# Altium schematic sheet CDR_WR_oscillators.SchDoc: RFSoC AMC
size 420 x 297 mm; CmpIndex: 26; CompanyName: WUT; DrawnBy: T. Przywozki; Organization: WUT ISE; Address1: Warsaw University of Technology; Address2: Nowowiejska 15/19 00-665 Warsaw; Address3: Tomasz.Przywozki@pw.edu.pl; DocumentNumber: 45; Revision: 1; SheetNumber: 45; SheetTotal: 45; Project: RFSoC AMC; ModifiedBy: T. Przywozki; CreateDate: -; CheckedDate: -; DivGrp: ISE; Designer: T. Przywozki; ModifiedDate: -; ProjectName: ADC/DAC MEZZANINE
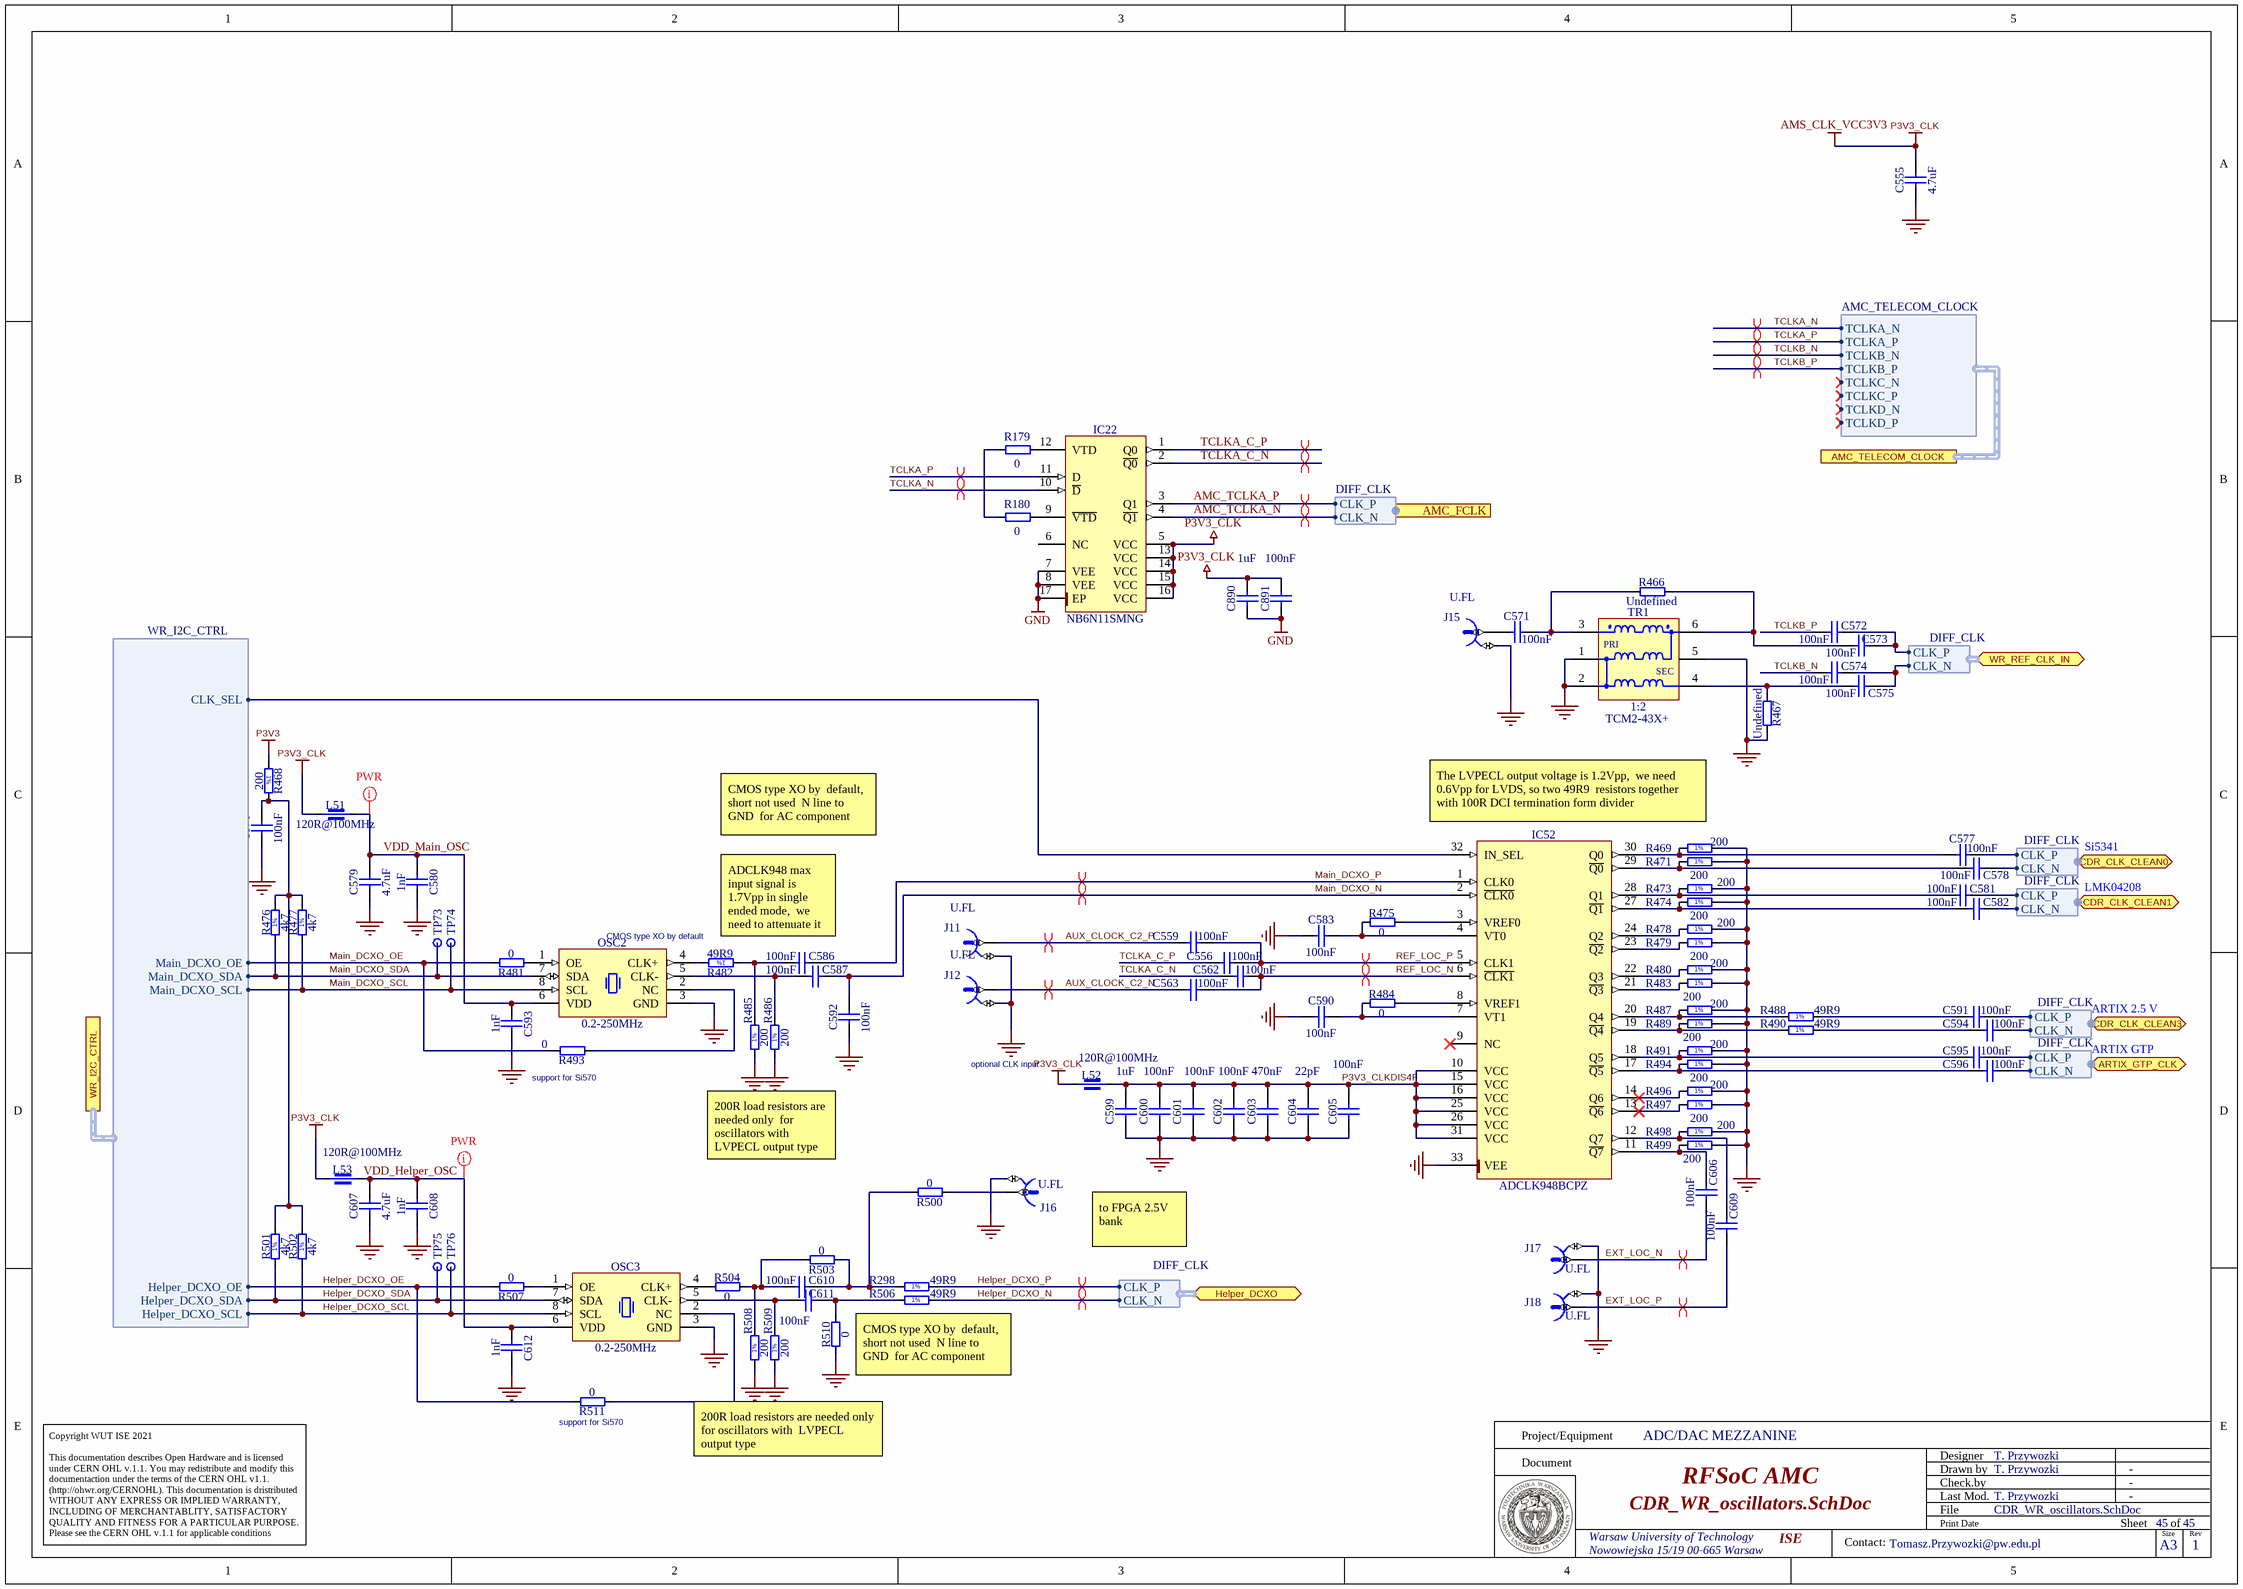
[diagram p0: CDR_WR_oscillators.SchDoc]

## Parts
C555  4.7uF  [CAPC1608X90N]
C556  100nF  [CAPC1005X55N]
C559  100nF  [CAPC1005X55N]
C562  100nF  [CAPC1005X55N]
C563  100nF  [CAPC1005X55N]
C571  100nF  [CAPC1005X55N]
C572  100nF  [CAPC1005X55N]
C573  100nF  [CAPC1005X55N]
C574  100nF  [CAPC1005X55N]
C575  100nF  [CAPC1005X55N]
C576  100nF  [CAPC0603X33N]
C577  100nF  [CAPC0603X33N]
C578  100nF  [CAPC0603X33N]
C579  4.7uF  [CAPC1608X90N]
C580  1nF  [CAPC0603X33N]
C581  100nF  [CAPC0603X33N]
C582  100nF  [CAPC0603X33N]
C583  100nF  [CAPC0603X33N]
C586  100nF  [CAPC1005X55N]
C587  100nF  [CAPC1005X55N]
C590  100nF  [CAPC0603X33N]
C591  100nF  [CAPC0603X33N]
C592  100nF  [CAPC0603X33N]
C593  1nF  [CAPC0603X33N]
C594  100nF  [CAPC0603X33N]
C595  100nF  [CAPC0603X33N]
C596  100nF  [CAPC0603X33N]
C599  1uF  [CAPC1005X55N]
C600  100nF  [CAPC0603X33N]
C601  100nF  [CAPC0603X33N]
C602  100nF  [CAPC0603X33N]
C603  470nF  [CAPC1005X55N]
C604  22pF  [CAPC1005X55N]
C605  100nF  [CAPC0603X33N]
C606  100nF  [CAPC0603X33N]
C607  4.7uF  [CAPC1608X90N]
C608  1nF  [CAPC0603X33N]
C609  100nF  [CAPC0603X33N]
C610  100nF  [CAPC1005X55N]
C611  100nF  [CAPC1005X55N]
C612  1nF  [CAPC0603X33N]
C890  1uF  [CAPC1005X55N]
C891  100nF  [CAPC0603X33N]
IC22  NB6N11SMNG  [QFN50P300X300X100-17N-S185]
IC52  ADCLK948BCPZ  [QFN50P500X500X80-33N-S285]
J11  U.FL  [HIROSE_U.FL-R-SMT-1(10)]
J12  U.FL  [HIROSE_U.FL-R-SMT-1(10)]
J15  U.FL  [HIROSE_U.FL-R-SMT-1(10)]
J16  U.FL  [HIROSE_U.FL-R-SMT-1(10)]
J17  U.FL  [HIROSE_U.FL-R-SMT-1(10)]
J18  U.FL  [HIROSE_U.FL-R-SMT-1(10)]
L51  120R@100MHz  [INDC1608X95N]
L52  120R@100MHz  [INDC1608X95N]
L53  120R@100MHz  [INDC1608X95N]
OSC2  0.2-250MHz  [OSC_SILICON-LAB_SI549-A]
OSC3  0.2-250MHz  [OSC_SILICON-LAB_SI549-A]
R179  0  [RESC1005X40N]
R180  0  [RESC1005X40N]
R298  49R9  [RESC1005X40N]
R466  Undefined  [RESC1005X40N]
R467  Undefined  [RESC1005X40N]
R468  200  [RESC1005X40N]
R469  200  [RESC1005X40N]
R471  200  [RESC1005X40N]
R473  200  [RESC1005X40N]
R474  200  [RESC1005X40N]
R475  0  [RESC1005X40N]
R476  4k7  [RESC1005X40N]
R477  4k7  [RESC1005X40N]
R478  200  [RESC1005X40N]
R479  200  [RESC1005X40N]
R480  200  [RESC1005X40N]
R481  0  [RESC1005X40N]
R482  49R9  [RESC1005X40N]
R483  200  [RESC1005X40N]
R484  0  [RESC1005X40N]
R485  200  [RESC1005X40N]
R486  200  [RESC1005X40N]
R487  200  [RESC1005X40N]
R488  49R9  [RESC1005X40N]
R489  200  [RESC1005X40N]
R490  49R9  [RESC1005X40N]
R491  200  [RESC1005X40N]
R493  0  [RESC1005X40N]
R494  200  [RESC1005X40N]
R496  200  [RESC1005X40N]
R497  200  [RESC1005X40N]
R498  200  [RESC1005X40N]
R499  200  [RESC1005X40N]
R500  0  [RESC1005X40N]
R501  4k7  [RESC1005X40N]
R502  4k7  [RESC1005X40N]
R503  0  [RESC1005X40N]
R504  0  [RESC1005X40N]
R506  49R9  [RESC1005X40N]
R507  0  [RESC1005X40N]
R508  200  [RESC1005X40N]
R509  200  [RESC1005X40N]
R510  0  [RESC1005X40N]
R511  0  [RESC1005X40N]
TP73  Test Point  [TPS127]  (value not drawn)
TP74  Test Point  [TPS127]  (value not drawn)
TP75  Test Point  [TPS127]  (value not drawn)
TP76  Test Point  [TPS127]  (value not drawn)
TR1  1:2  Manufacturer Part Number: TCM2-43X+  [XFMR_MINI-CIRCUITS_DB1627]

## Ports
AMC_FCLK (harness DIFF_CLK), AMC_TELECOM_CLOCK (harness AMC_TELECOM_CLOCK), ARTIX_GTP_CLK (bidir, harness DIFF_CLK), CDR_CLK_CLEAN0 (bidir, harness DIFF_CLK), CDR_CLK_CLEAN1 (bidir, harness DIFF_CLK), CDR_CLK_CLEAN3 (bidir, harness DIFF_CLK), Helper_DCXO (bidir, harness DIFF_CLK), WR_I2C_CTRL (harness WR_I2C_CTRL), WR_REF_CLK_IN (bidir, harness DIFF_CLK)

## Harnesses
AMC_TELECOM_CLOCK: TCLKA_N, TCLKA_P, TCLKB_N, TCLKB_P, TCLKC_N, TCLKC_P, TCLKD_N, TCLKD_P
WR_I2C_CTRL: Main_DCXO_OE, Main_DCXO_SDA, Main_DCXO_SCL, Helper_DCXO_OE, Helper_DCXO_SDA, Helper_DCXO_SCL, CLK_SEL
DIFF_CLK: CLK_P, CLK_N

## Nets
AMS_CLK_VCC3V3: C555.2 C890.1 C891.2 IC22.5(VCC) IC22.13(VCC) IC22.14(VCC) IC22.15(VCC) IC22.16(VCC) L51.1 L52.1 L53.1  [also labelled P3V3_CLK]
GND: C555.1 C576.1 C579.1 C580.1 C583.1 C590.1 C592.1 C593.1 C599.2 C600.1 C601.1 C602.1 C603.1 C604.1 C605.1 C607.1 C608.1 C612.1 C890.2 C891.1 IC22.7(VEE) IC22.8(VEE) IC22.17(EP) IC52.33(VEE) J11.2 J12.2 J15.2 J16.2 J17.2 J18.2 OSC2.3(GND) OSC3.3(GND) R467.1 R469.2 R471.2 R473.2 R474.2 R478.2 R479.2 R480.2 R483.2 R485.1 R486.1 R487.2 R489.2 R491.2 R494.2 R496.2 R497.2 R498.2 R499.2 R508.1 R509.1 R510.1 TR1.1(P1) TR1.2(P1) TR1.5(NC)
P3V3: R468.1
AMC_TCLKA_N: IC22.4(~{Q1}) ; port AMC_FCLK.CLK_N
AMC_TCLKA_P: IC22.3(Q1) ; port AMC_FCLK.CLK_P
AUX_CLOCK_C2_N: C563.1 J12.1
AUX_CLOCK_C2_P: C559.1 J11.1
EXT_LOC_N: C606.2 J17.1
EXT_LOC_P: C609.2 J18.1
Helper_DCXO_N: R506.2 ; port Helper_DCXO.CLK_N
Helper_DCXO_OE: R507.2 R511.2 ; port WR_I2C_CTRL.Helper_DCXO_OE
Helper_DCXO_P: R298.2 ; port Helper_DCXO.CLK_P
Helper_DCXO_SCL: OSC3.8(SCL) R502.1 TP76.1 ; port WR_I2C_CTRL.Helper_DCXO_SCL
Helper_DCXO_SDA: OSC3.7(SDA) R501.1 TP75.1 ; port WR_I2C_CTRL.Helper_DCXO_SDA
Main_DCXO_N: C587.2 C592.2 IC52.2(~{CLK0})
Main_DCXO_OE: R481.2 R493.2 ; port WR_I2C_CTRL.Main_DCXO_OE
Main_DCXO_P: C586.2 IC52.1(CLK0)
Main_DCXO_SCL: OSC2.8(SCL) R477.1 TP74.1 ; port WR_I2C_CTRL.Main_DCXO_SCL
Main_DCXO_SDA: OSC2.7(SDA) R476.1 TP73.1 ; port WR_I2C_CTRL.Main_DCXO_SDA
P3V3_CLKDIS4F: C599.1 C600.2 C601.2 C602.2 C603.2 C604.2 C605.2 IC52.10(VCC) IC52.15(VCC) IC52.16(VCC) IC52.25(VCC) IC52.26(VCC) IC52.31(VCC) L52.2
REF_LOC_N: C562.2 C563.2 IC52.6(~{CLK1})
REF_LOC_P: C556.2 C559.2 IC52.5(CLK1)
TCLKA_C_N: C562.1 IC22.2(~{Q0})
TCLKA_C_P: C556.1 IC22.1(Q0)
TCLKA_N: IC22.10(~{D}) ; port AMC_TELECOM_CLOCK.TCLKA_N
TCLKA_P: IC22.11(D) ; port AMC_TELECOM_CLOCK.TCLKA_P
TCLKB_N: C574.1 ; port AMC_TELECOM_CLOCK.TCLKB_N
TCLKB_P: C572.1 ; port AMC_TELECOM_CLOCK.TCLKB_P
VDD_Helper_OSC: C607.2 C608.2 C612.2 L53.2 OSC3.6(VDD)
VDD_Main_OSC: C579.2 C580.2 C593.2 L51.2 OSC2.6(VDD)
NetC571_1: C571.1 J15.1
NetC571_2: C571.2 R466.2 TR1.3(P1)
NetC572_2: C572.2 C573.2 ; port WR_REF_CLK_IN.CLK_P
NetC573_1: C573.1 R466.1 TR1.6(S1)
NetC574_2: C574.2 C575.2 ; port WR_REF_CLK_IN.CLK_N
NetC575_1: C575.1 R467.2 TR1.4(S1)
NetC576_2: C576.2 R468.2 R476.2 R477.2 R501.2 R502.2
NetC577_1: C577.1 IC52.30(Q0) R469.1
NetC577_2: C577.2 ; port CDR_CLK_CLEAN0.CLK_P
NetC578_1: C578.1 IC52.29(~{Q0}) R471.1
NetC578_2: C578.2 ; port CDR_CLK_CLEAN0.CLK_N
NetC581_1: C581.1 IC52.28(Q1) R473.1
NetC581_2: C581.2 ; port CDR_CLK_CLEAN1.CLK_P
NetC582_1: C582.1 IC52.27(~{Q1}) R474.1
NetC582_2: C582.2 ; port CDR_CLK_CLEAN1.CLK_N
NetC583_2: C583.2 IC52.4(VT0) R475.1
NetC586_1: C586.1 R482.1 R485.2
NetC587_1: C587.1 OSC2.5(CLK-) R486.2
NetC590_2: C590.2 IC52.7(VT1) R484.1
NetC591_1: C591.1 R488.2
NetC591_2: C591.2 ; port CDR_CLK_CLEAN3.CLK_P
NetC594_1: C594.1 R490.2
NetC594_2: C594.2 ; port CDR_CLK_CLEAN3.CLK_N
NetC595_1: C595.1 IC52.18(Q5) R491.1
NetC595_2: C595.2 ; port ARTIX_GTP_CLK.CLK_P
NetC596_1: C596.1 IC52.17(~{Q5}) R494.1
NetC596_2: C596.2 ; port ARTIX_GTP_CLK.CLK_N
NetC606_1: C606.1 IC52.11(~{Q7}) R499.1
NetC609_1: C609.1 IC52.12(Q7) R498.1
NetC610_1: C610.1 R503.2 R504.2 R508.2
NetC610_2: C610.2 R298.1 R500.2 R503.1
NetC611_1: C611.1 OSC3.5(CLK-) R509.2
NetC611_2: C611.2 R506.1 R510.2
NetIC22_9: IC22.9(~{VTD}) R180.2
NetIC22_12: IC22.12(VTD) R179.2
NetIC52_3: IC52.3(VREF0) R475.2
NetIC52_8: IC52.8(VREF1) R484.2
NetIC52_13: IC52.13(~{Q6}) R497.1
NetIC52_14: IC52.14(Q6) R496.1
NetIC52_19: IC52.19(~{Q4}) R489.1 R490.1
NetIC52_20: IC52.20(Q4) R487.1 R488.1
NetIC52_21: IC52.21(~{Q3}) R483.1
NetIC52_22: IC52.22(Q3) R480.1
NetIC52_23: IC52.23(~{Q2}) R479.1
NetIC52_24: IC52.24(Q2) R478.1
NetIC52_32: IC52.32(IN_SEL) ; port WR_I2C_CTRL.CLK_SEL
NetJ16_1: J16.1 R500.1
NetOSC2_1: OSC2.1(OE) R481.1
NetOSC2_2: OSC2.2(NC) R493.1
NetOSC2_4: OSC2.4(CLK+) R482.2
NetOSC3_1: OSC3.1(OE) R507.1
NetOSC3_2: OSC3.2(NC) R511.1
NetOSC3_4: OSC3.4(CLK+) R504.1
NetR179_1: R179.1 R180.1

Not connected (* = marked no-connect by the designer): IC22 6(NC); IC52 9(NC)*

## Layout directives
differential pair; differential pair class 100Ohm: AMC_TCLKA_N, AMC_TCLKA_P, AUX_CLOCK_C2_N, AUX_CLOCK_C2_P, EXT_LOC_N, EXT_LOC_P, Helper_DCXO_N, Helper_DCXO_P, Main_DCXO_N, Main_DCXO_P, REF_LOC_N, REF_LOC_P, TCLKA_C_N, TCLKA_C_P
differential pair: TCLKA_N, TCLKA_P, TCLKB_N, TCLKB_P
net class PWR: VDD_Helper_OSC, VDD_Main_OSC

## Notes on the sheet
- CMOS type XO by  default, short not used  N line to GND  for AC component
- The LVPECL output voltage is 1.2Vpp,  we need 0.6Vpp for LVDS, so two 49R9  resistors together with 100R DCI termination form divider
- Si5341
- CMOS type XO by default
- ADCLK948 max input signal is 1.7Vpp in single  ended mode,  we need to attenuate it
- LMK04208
- (near L52) optional CLK input
- ARTIX 2.5 V
- ARTIX GTP
- (near R493) support for Si570
- 200R load resistors are needed only  for oscillators with  LVPECL output type
- to FPGA 2.5V bank
- (near R511) support for Si570
- Project/Equipment
- Document
- Designer
- Drawn by
- Check.by
- Copyright WUT ISE 2021
  This documentation describes Open Hardware and is licensed under CERN OHL v.1.1. You may redistribute and modify this documentaction under the terms of the CERN OHL v1.1.
  (http://ohwr.org/CERNOHL). This documentation is dristributed WITHOUT ANY EXPRESS OR IMPLIED WARRANTY, INCLUDING OF MERCHANTABLITY, SATISFACTORY QUALITY AND FITNESS FOR A PARTICULAR PURPOSE. Please see the CERN OHL v.1.1 for applicable conditions
- File
- Last Mod.
- Print Date
- Sheet
- Size
- A3
- of
- Rev
- Contact:
- (in symbol R0402_4K7_1%_0.0625W_100PPM) 1%
- (in symbol R0402_49R9_1%_0.0625W_100PPM) 1%
- (in symbol R0402_200R_1%_0.0625W_100PPM) 1%
- (in symbol XFMR_MINI-CIRCUITS_TCM2-43X+) PRI; SEC

## Library data of the parts
C555 C579 C607 = CC0603_4.7UF_25V_10%_X5R: Non-polarised capacitor; Manufacturer: GENERIC; Part Description: SMD Multilayer Chip Ceramic Capacitor; Manufacturer1 Part Number: GRM188R61E475KE11D; Tolerance: ±10%; Voltage: 25V; TC: X5R; Manufacturer Part Number: CC0603_4.7UF_25V_10%_X5R; Part Number: CC0603_4.7UF_25V_10%_X5R; Value: 4.7uF; Component Kind: Standard; Component Type: Standard; Pin Count: 2; Status: None; Case: 0603; Mounted: Yes; Socket: No; SMD: Yes; Sense: No; Manufacturer1 Example: MURATA; Manufacturer1 ComponentHeight: 0.95mm; HelpURL: \\cern.ch\dfs\Applications\Altium\Datasheets\CC0603_MURATA_GRM188R61E475KE11D.pdf; Author: CERN DEM JLC; CreateDate: 10.11.2014; LatestRevisionDate: 10.11.2014
C556 C559 C562 C563 C571-C575 C586 C587 C610 C611 = CC0402_100NF_16V_10%_X5R: Non-polarised capacitor; Manufacturer: GENERIC; Manufacturer1 Part Number: GRM155R61C104KA88D; Part Description: SMD Multilayer Chip Ceramic Capacitor; TC: X5R; Tolerance: ±10%; Voltage: 16V; Case: 0402; Manufacturer Part Number: CC0402_100NF_16V_10%_X5R; Manufacturer1 Example: MURATA; Part Number: CC0402_100NF_16V_10%_X5R; Pin Count: 2; SMD: Yes; Status: None; Value: 100nF; Component Kind: Standard; Component Type: Standard; Mounted: Yes; Socket: No; Sense: No; Manufacturer1 ComponentHeight: 0.55mm; HelpURL: \\cern.ch\dfs\Applications\Altium\Datasheets\CC0402_X5R_MURATA_GRM.pdf; Author: CERN DEM JLC; CreateDate: 10.12.2013; LatestRevisionDate: 10.12.2013
C576-C578 C581-C583 C590-C592 C594-C596 C600-C602 C605 C606 C609 C891 = CC0201_100NF_6.3V_10%_X5R: Non-polarised capacitor; Manufacturer: GENERIC; Part Description: SMD Multilayer Chip Ceramic Capacitor; Manufacturer1 Part Number: 02016D104KAT2A; Tolerance: ±10%; Voltage: 6.3V; TC: X5R; Manufacturer Part Number: CC0201_100NF_6.3V_10%_X5R; Part Number: CC0201_100NF_6.3V_10%_X5R; Value: 100nF; Component Kind: Standard; Component Type: Standard; Pin Count: 2; Status: Not Recommended; Case: 0201; Mounted: Yes; Socket: No; SMD: Yes; Sense: No; Manufacturer1 Example: AVX; Manufacturer1 ComponentHeight: 0.33mm; HelpURL: \\cern.ch\dfs\Applications\Altium\Datasheets\CC0201_X5R_AVX.pdf; Author: CERN DEM JLC; CreateDate: 03.12.2007; LatestRevisionDate: 03.12.2007
C580 C593 C608 C612 = CC0201_1NF_16V_10%_X5R: Non-polarised capacitor; Manufacturer: GENERIC; Part Description: SMD Multilayer Chip Ceramic Capacitor; Manufacturer1 Part Number: 0201YD102KAT2A; Tolerance: ±10%; Voltage: 16V; TC: X5R; Manufacturer Part Number: CC0201_1NF_16V_10%_X5R; Part Number: CC0201_1NF_16V_10%_X5R; Value: 1nF; Component Kind: Standard; Component Type: Standard; Pin Count: 2; Status: Not Recommended; Case: 0201; Mounted: Yes; Socket: No; SMD: Yes; Sense: No; Manufacturer1 Example: AVX; Manufacturer1 ComponentHeight: 0.33mm; HelpURL: \\cern.ch\dfs\Applications\Altium\Datasheets\CC0201_X5R_AVX.pdf; Author: CERN DEM JLC; CreateDate: 03.12.2007; LatestRevisionDate: 03.12.2007
C599 C890 = CC0402_1UF_16V_10%_X5R: Non-polarised capacitor; Manufacturer: GENERIC; Part Description: SMD Multilayer Chip Ceramic Capacitor; Manufacturer1 Part Number: C1005X5R1C105KT; Tolerance: ±10%; Voltage: 16V; TC: X5R; Manufacturer Part Number: CC0402_1UF_16V_10%_X5R; Part Number: CC0402_1UF_16V_10%_X5R; Value: 1uF; Component Kind: Standard; Component Type: Standard; Pin Count: 2; Status: Preferred; Case: 0402; Mounted: Yes; Socket: No; SMD: Yes; Sense: No; Manufacturer1 Example: TDK; Manufacturer1 ComponentHeight: 0.55mm; HelpURL: \\cern.ch\dfs\Applications\Altium\Datasheets\CC0402_X5R_TDK_C.pdf; Author: CERN DEM JLC; CreateDate: 25.10.2012; LatestRevisionDate: 25.10.2012
C603 = CC0402_470NF_16V_10%_X5R: Non-polarised capacitor; Manufacturer: GENERIC; Part Description: SMD Multilayer Chip Ceramic Capacitor; Manufacturer1 Part Number: C1005X5R1C105KT; Tolerance: ±10%; Voltage: 16V; TC: X5R; Manufacturer Part Number: CC0402_470NF_16V_10%_X5R; Part Number: CC0402_470NF_16V_10%_X5R; Value: 470nF; Component Kind: Standard; Component Type: Standard; Pin Count: 2; Status: Preferred; Case: 0402; Mounted: Yes; Socket: No; SMD: Yes; Sense: No; Manufacturer1 Example: TDK; Manufacturer1 ComponentHeight: 0.55mm; HelpURL: \\cern.ch\dfs\Applications\Altium\Datasheets\CC0402_X5R_TDK_C.pdf; Author: CERN DEM JLC; CreateDate: 25.10.2012; LatestRevisionDate: 25.10.2012
C604 = CC0402_22PF_50V_5%_C0G: Non-polarised capacitor; Manufacturer: GENERIC; Part Description: SMD Multilayer Chip Ceramic Capacitor; Manufacturer1 Part Number: C0402C220J5GACTU; Tolerance: ±5%; Voltage: 50V; TC: C0G/NP0; Manufacturer Part Number: CC0402_22PF_50V_5%_C0G; Part Number: CC0402_22PF_50V_5%_C0G; Value: 22pF; Component Kind: Standard; Component Type: Standard; Pin Count: 2; Status: Preferred; Case: 0402; Mounted: Yes; Socket: No; SMD: Yes; Sense: No; Manufacturer1 Example: KEMET; Manufacturer1 ComponentHeight: 0.55mm; HelpURL: \\cern.ch\dfs\Applications\Altium\Datasheets\CC0805_C0G_KEMET_(Commercial Grade).pdf; Author: CERN DEM JLC; CreateDate: 03.12.2007; LatestRevisionDate: 03.12.2007
IC22 = NB6N11SMNG: 3.3V 1:2 AnyLevel Input to LVDS Fanout Buffer / Translator; Manufacturer: ON SEMICONDUCTOR; PressFit: No; Bonding: No; Part Number: NB6N11SMNG; Component Kind: Standard; Component Type: Standard; Device: NB6N11SMNG; PackageDescription: QFN, 0.50mm Pitch, Square; 16 Pin, 3.00mm L X 3.00mm W X 1.00mm H body (w/Thermal Tab 1.85 X 1.85mm), IPC Medium Density; Part Description: 3.3V 1:2 AnyLevel Input to LVDS Fanout Buffer / Translator; Manufacturer Part Number: NB6N11SMNG; Pin Count: 17; Case: QFN16; Mounted: Yes; Socket: No; SMD: Yes; Sense: No; ComponentHeight: 1mm; Author: CERN DEM JLC; HelpURL: \\cern.ch\dfs\Applications\Altium\Datasheets\NB6N11SMNG.pdf; CreateDate: 14.05.2013; LatestRevisionDate: 14.05.2013
IC52 = ADCLK948BCPZ: Two Selectable Inputs, 8 LVPECL Outputs, SiGe Clock Fanout Buffer; Manufacturer: ANALOG DEVICES; PressFit: No; Bonding: No; Manufacturer Part Number: ADCLK948BCPZ; Part Description: Two Selectable Inputs, 8 LVPECL Outputs, SiGe Clock Fanout Buffer; Part Number: ADCLK948BCPZ; Component Kind: Standard; Component Type: Standard; Device: ADCLK948BCPZ; PackageDescription: QFN, 0.50mm Pitch, Square; 8 Pin X 8 Pin, 5mm X 5mm X 1.00mm H body (w/thermal tab 2.85 X 2.85mm),  IPC Medium Density; Pin Count: 33; Case: QFN32; Mounted: Yes; Socket: No; SMD: Yes; Sense: No; ComponentHeight: 0.8mm; Author: CERN DEM MR; HelpURL: \\cern.ch\dfs\Applications\Altium\Datasheets\ADCLK948BCPZ.pdf; CreateDate: 30.11.2016; LatestRevisionDate: 30.11.2016
J11 J12 J15-J18 = HIROSE_U.FL-R-SMT-1(10): Manufacturer: HIROSE (HRS); Part Description: Up to 6GHz Ultra Small Surface Mount Male Coaxial Connectors U.FL Series; PressFit: No; Manufacturer Part Number: U.FL-R-SMT-1(10); Part Number: HIROSE_U.FL-R-SMT-1(10); Component Kind: Standard; Component Type: Standard; Pin Count: 2; Family: U.FL; Mounted: Yes; Socket: No; SMD: Yes; Sense: No; Status: None; ComponentHeight: 1.25mm; HelpURL: \\cern.ch\dfs\Applications\Altium\Datasheets\HIROSE_U.FL-R-SMT-1(10).pdf; Author: CERN DEM JLC; CreateDate: 24.03.2010; LatestRevisionDate: 24.03.2010
L51-L53 = IND0603_MURATA_BLM18PG121SN1D: Manufacturer: MURATA; Part Description: SMD EMIFIL Chip Ferrite Bead; Power: 2A; Resistance: 0.05R; Manufacturer Part Number: BLM18PG121SN1D; Part Number: IND0603_MURATA_BLM18PG121SN1D; Value: 120R@100MHz; Component Kind: Standard; Component Type: Standard; Pin Count: 2; Status: None; Case: 0603; Mounted: Yes; Socket: No; SMD: Yes; Sense: No; ComponentHeight: 0.95mm; HelpURL: \\cern.ch\dfs\Applications\Altium\Datasheets\IND0603_MURATA_BLM18P.pdf; Author: CERN DEM BC; CreateDate: 27.07.2015; LatestRevisionDate: 25.10.2018
OSC2 OSC3 = OSC_0.2-250MHZ_SILICON-LAB_549CBAC000112ABG: Any-Rate I2C Programmable XO Oscillator Si549 Series; Part Description: 0.2-250MHz, 1.8V/2.5V/3.3V ±10ppm CMOS , Any-Rate I2C Programmable XO Oscillator Si549 Series; Manufacturer: SILICON LABS; PressFit: No; Bonding: No; Part Number: OSC_0.2-250MHZ_SILICON-LAB_549CBAC000112ABG; Component Kind: Standard; Component Type: Standard; PackageDescription: Oscillator Si549 Series, 8 pins, 5x7mm; Value: 0.2-250MHz; Manufacturer Part Number: 549CBAC000112ABG; Pin Count: 8; Mounted: Yes; Socket: No; SMD: Yes; Sense: No; ComponentHeight: 1.33mm; HelpURL: \\cern.ch\dfs\Applications\Altium\Datasheets\OSC_SILICON-LAB_SI549.pdf; Author: CERN DEM BC; CreateDate: 25.10.2019; LatestRevisionDate: 25.10.2019
R179 R180 = R0402_0R_JUMPER: Resistor; Part Description: 1A (0.05R Max DC Resistance) Zero Ohm Jumper; Manufacturer: GENERIC; Manufacturer1 Part Number: 232270591001L; PressFit: No; Part Number: R0402_0R_JUMPER; Component Kind: Standard; Component Type: Standard; Pin Count: 2; Value: 0; Status: Not Recommended; Manufacturer Part Number: R0402_0R_JUMPER; Case: 0402; Mounted: Yes; Sense: No; Socket: No; SMD: Yes; Manufacturer1 Example: YAGEO PHYCOMP; Manufacturer1 ComponentHeight: 0.4mm; HelpURL: \\cern.ch\dfs\Applications\Altium\Datasheets\R0402_Phycomp_RC0402.pdf; Author: CERN DEM JLC; CreateDate: 03.12.2007; LatestRevisionDate: 17.10.2012
R298 R482 R488 R490 R506 = R0402_49R9_1%_0.0625W_100PPM: Resistor - 1%; Manufacturer: GENERIC; Part Description: General Purpose Thick Film Chip Resistor; Manufacturer1 Part Number: 232270674999L or RC0402FR-0749R9L; TC: ±100ppm/°C; PressFit: No; Manufacturer Part Number: R0402_49R9_1%_0.0625W_100PPM; Part Number: R0402_49R9_1%_0.0625W_100PPM; Tolerance: ±1%; Value: 49R9; Component Kind: Standard; Component Type: Standard; Pin Count: 2; Status: Not Recommended; Power: 0.0625W; Case: 0402; Mounted: Yes; Sense: No; Socket: No; SMD: Yes; Manufacturer1 Example: YAGEO PHYCOMP; Manufacturer1 ComponentHeight: 0.4mm; HelpURL: \\cern.ch\dfs\Applications\Altium\Datasheets\R0402_Phycomp_RC0402.pdf; Author: CERN DEM JLC; CreateDate: 24.10.2012; LatestRevisionDate: 24.10.2012
R466 R467 = R0402_NO-VALUE: Resistor; Part Description: Reserved Footprint For a 0402 (1005) Chip Resistor; PressFit: No; Mounted: No; Manufacturer Part Number: R0402_NO-VALUE; Manufacturer: Undefined; Part Number: R0402_NO-VALUE; Value: Undefined; Component Kind: Standard; Component Type: Standard; Pin Count: 2; Status: None; Case: 0402; Sense: No; Socket: No; SMD: Yes; Manufacturer1 Example: Undefined; Manufacturer1 Part Number: Undefined; Manufacturer1 ComponentHeight: Undefined; HelpURL: Undefined; Author: CERN DEM JLC; CreateDate: 03.12.2007; LatestRevisionDate: 13.03.2008
R468 R469 R471 R473 R474 R478-R480 R483 R485-R487 R489 R491 R494 R496-R499 R508 R509 = R0402_200R_1%_0.0625W_100PPM: Resistor - 1%; Manufacturer: GENERIC; Part Description: General Purpose Thick Film Chip Resistor; Manufacturer1 Part Number: 232270672001L; TC: ±100ppm/°C; PressFit: No; Manufacturer Part Number: R0402_200R_1%_0.0625W_100PPM; Part Number: R0402_200R_1%_0.0625W_100PPM; Tolerance: ±1%; Value: 200; Component Kind: Standard; Component Type: Standard; Pin Count: 2; Status: Not Recommended; Power: 0.0625W; Case: 0402; Mounted: Yes; Sense: No; Socket: No; SMD: Yes; Manufacturer1 Example: YAGEO PHYCOMP; Manufacturer1 ComponentHeight: 0.4mm; HelpURL: \\cern.ch\dfs\Applications\Altium\Datasheets\R0402_Phycomp_RC0402.pdf; Author: CERN DEM JLC; CreateDate: 03.12.2007; LatestRevisionDate: 17.10.2012
R475 R481 R484 R493 R500 R503 R504 R507 R510 R511 = R0402_0R_JUMPER: Resistor; Manufacturer: GENERIC; Part Description: 1A (0.05R Max DC Resistance) Zero Ohm Jumper; Manufacturer1 Part Number: 232270591001L; PressFit: No; Manufacturer Part Number: R0402_0R_JUMPER; Part Number: R0402_0R_JUMPER; Value: 0; Component Kind: Standard; Component Type: Standard; Pin Count: 2; Status: Not Recommended; Case: 0402; Mounted: Yes; Sense: No; Socket: No; SMD: Yes; Manufacturer1 Example: YAGEO PHYCOMP; Manufacturer1 ComponentHeight: 0.4mm; HelpURL: \\cern.ch\dfs\Applications\Altium\Datasheets\R0402_Phycomp_RC0402.pdf; Author: CERN DEM JLC; CreateDate: 03.12.2007; LatestRevisionDate: 17.10.2012
R476 R477 R501 R502 = R0402_4K7_1%_0.0625W_100PPM: Resistor - 1%; Manufacturer: GENERIC; Part Description: General Purpose Thick Film Chip Resistor; Manufacturer1 Part Number: 232270674702L; TC: ±100ppm/°C; PressFit: No; Manufacturer Part Number: R0402_4K7_1%_0.0625W_100PPM; Part Number: R0402_4K7_1%_0.0625W_100PPM; Tolerance: ±1%; Value: 4k7; Component Kind: Standard; Component Type: Standard; Pin Count: 2; Status: Not Recommended; Power: 0.0625W; Case: 0402; Mounted: Yes; Sense: No; Socket: No; SMD: Yes; Manufacturer1 Example: YAGEO PHYCOMP; Manufacturer1 ComponentHeight: 0.4mm; HelpURL: \\cern.ch\dfs\Applications\Altium\Datasheets\R0402_Phycomp_RC0402.pdf; Author: CERN DEM JLC; CreateDate: 03.12.2007; LatestRevisionDate: 17.10.2012
TP73-TP76 = SMD_PAD_1.27X1.27MM: Part Description: 1.27mm x 1.27mm PCB Copper Area (SMD Test Point); Mounted: No; Part Number: SMD_PAD_1.27X1.27MM; Component Kind: Standard (No BOM); Component Type: Standard (No BOM); Pin Count: 1; Family: Test Point; Socket: No; SMD: Yes; Sense: No; Status: None; ComponentHeight: 0mm; HelpURL: Undefined; Author: CERN DEM JLC; CreateDate: 12.01.2008; LatestRevisionDate: 12.01.2008; PackageDescription: 1.27mm x 1.27mm PCB Copper Area (SMD Test Point)
TR1 = XFMR_MINI-CIRCUITS_TCM2-43X+: 50 OHMS 10 to 4000 MHz RF Transformer; Power: 0.4W; Part Number: XFMR_MINI-CIRCUITS_TCM2-43X+; Component Kind: Standard; Component Type: Standard; Pin Count: 6; Value: 1:2; Status: None; Part Description: 50 Ohms 10 to 4000MHz RF Transformer; Manufacturer: MINI-CIRCUITS; Mounted: Yes; Socket: No; Sense: No; SMD: Yes; ComponentHeight: 4.06mm; HelpURL: \\cern.ch\dfs\Applications\Altium\Datasheets\XFMR_MINI-CIRCUITS_TCM2-43X+.pdf; Author: CERN DEM BC; CreateDate: 12.02.2016; LatestRevisionDate: 12.02.2016